# EAGLE design Power_5V&77V (EAGLE 7.1.0)
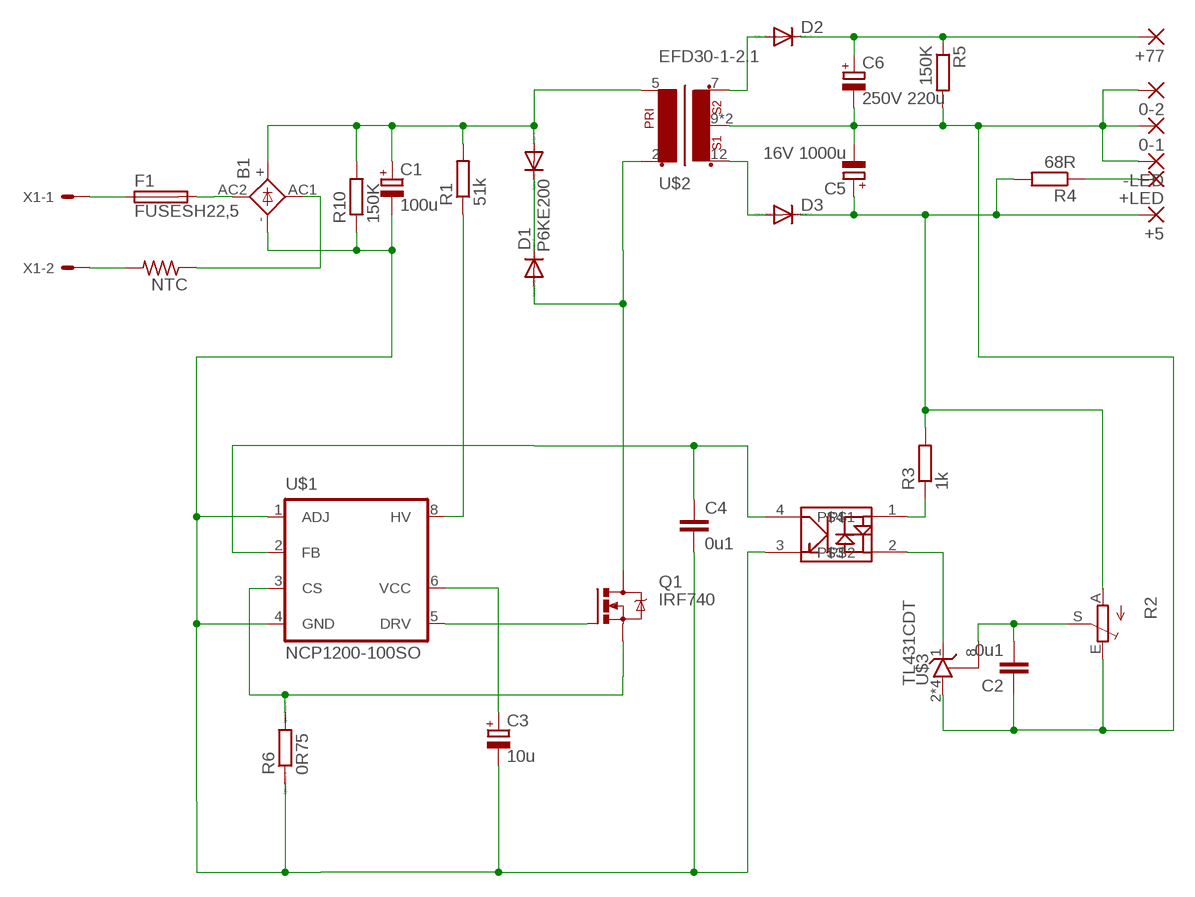
[diagram p0: schematic, sheet 1]

## Parts
0-1  2,54/0,8  [2,54/0,8]
0-2  3,17/1,1  [3,17/1,1]
+5  2,54/0,8  [2,54/0,8]
+77  3,17/1,1  [3,17/1,1]
+LED  2,54/0,8  [2,54/0,8]
-LED  2,54/0,8  [2,54/0,8]
B1  KBL  [KBL]
C1  100u  CPOL-EUE10-25  [EB25D]
C2  0u1  C-EUC1206  [C1206]
C3  10u  CPOL-EUE2.5-5  [E2,5-5]
C4  0u1  C-EUC1206  [C1206]
C5  16V 1000u  CPOL-EUE3.5-8  [E3,5-8]
C6  250V 220u  CPOL-EUE10-22.5  [EB22,5D]
D1  DIODE-DO-214AC  [DO-214AC]
D2  DIODE-TO220V  [TO220ACS]
D3  DIODE-SMB  [SMB]
F1  FUSESH22,5  SH22,5  [SH22,5]
NTC  R-US_0207/10  [0207/10]
P6KE200  DIODE-SMB  [SMB]
Q1  IRF740  [TO220BV]
R1  51k  R-EU_0922/22  [0922/22]
R2  TRIM_EU-S75H  [S75H]
R3  1k  R-EU_R1206  [R1206]
R4  68R  R-EU_R1206  [R1206]
R5  150K  R-EU_R1206  [R1206]
R6  0R75  R-EU_0411_15  [0411/15]
R10  150K  R-EU_0207/10  [0207/10]
U$1  NCP1200-100SO  [SOP8]
U$2  EFD30-1-2.1  [EFD30_1-2.1]
U$3  TL431CDT  [SO8]
U$5  EL3H4(TA)-VG  [SSOP4]
X1  KK-156-2  [KK-156-2]

## Nets
N$1: NTC.2 X1.2
N$2: F1.1 X1.1
N$3: B1.AC1(AC2) NTC.1
N$4: B1.AC2(AC1) F1.2
N$5: C4.1 U$1.2(FB) U$5.4
N$6: B1.+ C1.+ P6KE200.A R1.2 R10.2 U$2.5(P1-2)
N$7: D1.C P6KE200.C
N$8: D1.A Q1.D U$2.2(P1-1)
N$9: C2.2 R2.S U$3.8(R)
N$10: R1.1 U$1.8(HV)
N$11: Q1.G U$1.5(DRV)
N$12: Q1.S R6.2 U$1.3(CS)
N$13: R3.1 U$5.1
N$14: C3.+ U$1.6(VCC)
N$15: U$3.1(C) U$5.2
N$16: B1.- C1.- C3.- C4.2 R6.1 R10.1 U$1.1(ADJ) U$1.4(GND) U$5.3
N$17: D2.A U$2.7(S2)
N$18: 0-1.1(P) 0-2.1(P) -LED.1(P) C2.1 C5.- C6.- R2.E R5.2 U$2.9(S0) U$2.10(S0) U$3.2(A) U$3.3(A) U$3.6(A) U$3.7(A)
N$19: +5.1(P) C5.+ D3.C R2.A R3.2 R4.2
N$20: +77.1(P) C6.+ D2.C R5.1
N$21: D3.A U$2.12(S1)
N$23: +LED.1(P) R4.1

## Library data of the parts
0-1 +5 +LED -LED = wirepad:2,54/0,8: THROUGH-HOLE PAD
0-2 +77 = wirepad:3,17/1,1: THROUGH-HOLE PAD
B1 = rectifier:KBL: DIOTEC RECTIFIER
C1 C3 C5 C6 = rcl:CPOL-EU: POLARIZED CAPACITOR, European symbol
C2 C4 = rcl:C-EU: CAPACITOR, European symbol
D1-D3 P6KE200 = diode:DIODE-: DIODE
F1 = fuse:SH22,5: FUSE HOLDER grid 22,5 mm, OGN0031 8201, Schurter (Buerklin); MF: SCHURTER; MPN: 0031.8201; OC_FARNELL: 1162740; OC_NEWARK: 96F8317
NTC = rcl:R-US_: RESISTOR, American symbol
Q1 = transistor-power:IRF740: N-CHANNEL MOS FET
R1 R3-R5 R10 = rcl:R-EU_: RESISTOR, European symbol
R2 = pot:TRIM_EU-: POTENTIOMETER
R6 = resistor:R-EU_: RESISTOR, European symbol; SPICEPREFIX: R
U$1 = NCP1200:NCP1200-100
U$2 = EFD25:EFD30-1-2.1
U$3 = Namenlos:TL431
U$5 = Namenlos:EL3H4(TA)-VG
X1 = con-molex:KK-156-2: KK 156 HEADER Source: http://www.molex.com/pdm_docs/sd/026604100_sd.pdf; OC_FARNELL: unknown; OC_NEWARK: unknown

## Board
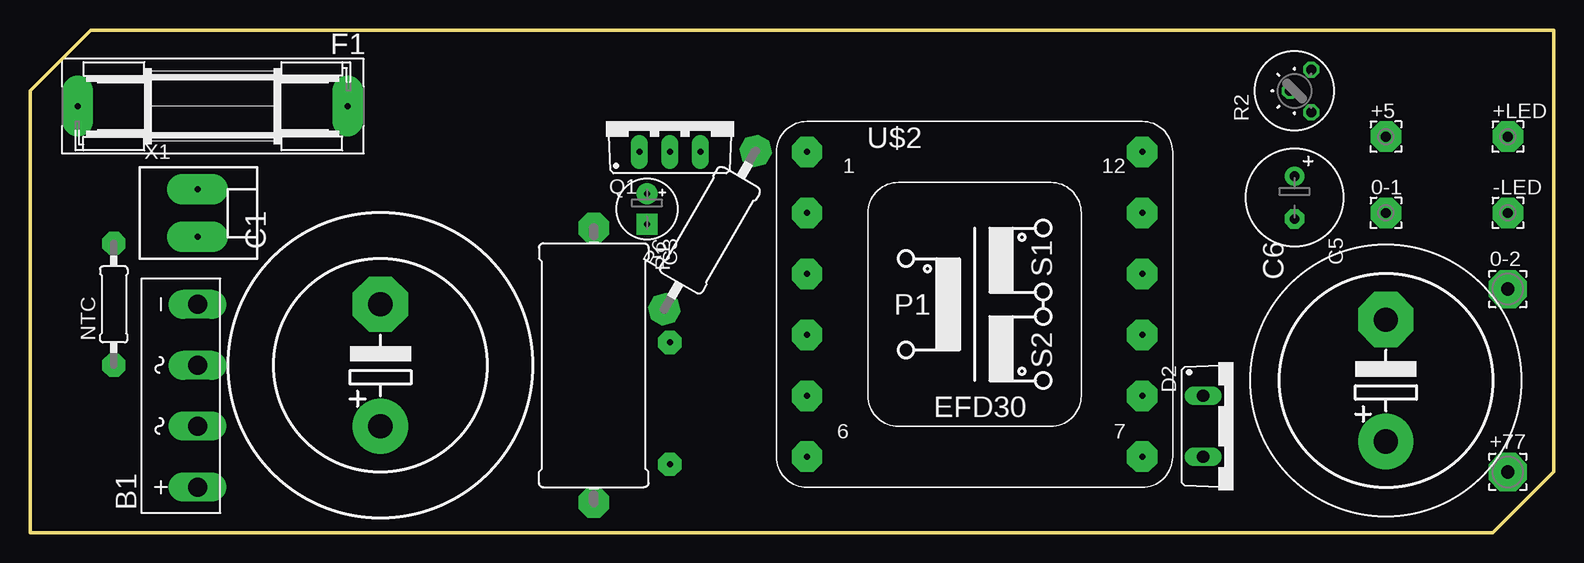
[diagram p1: board, top side]
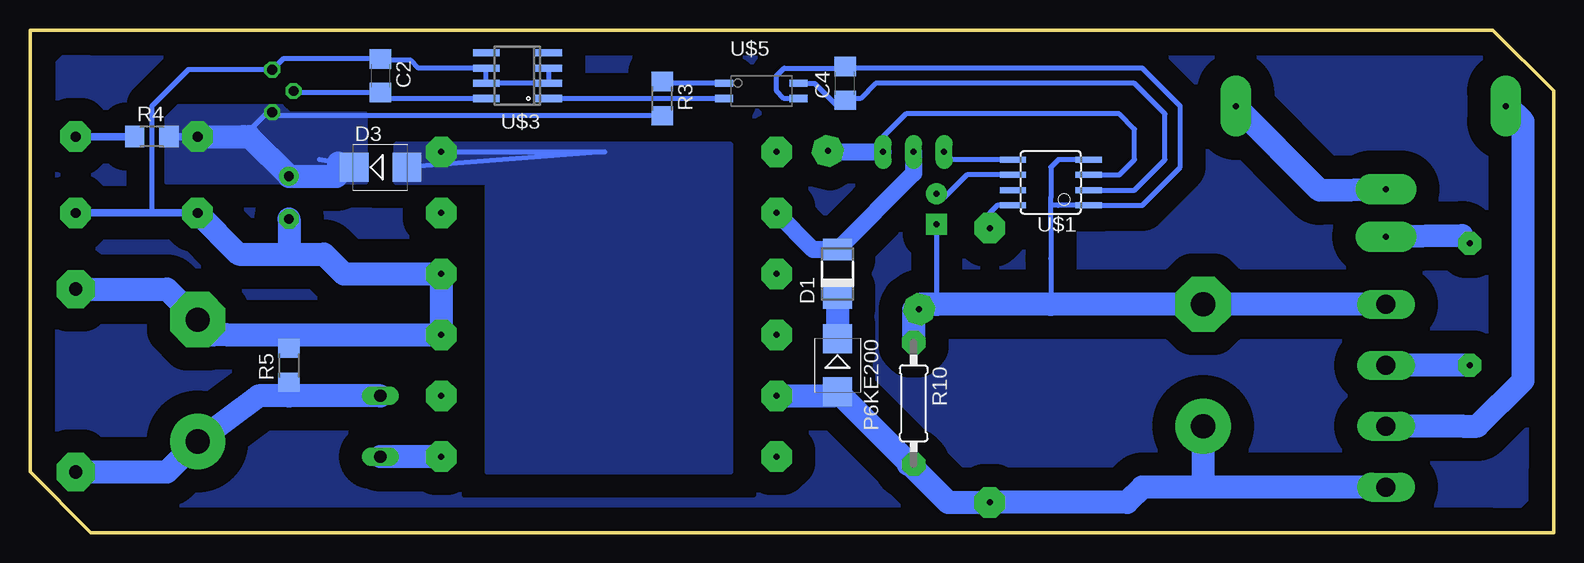
[diagram p2: board, bottom side, seen from below]

Size 127 x 41.91 mm. Coordinates in mm from the lower left corner, seen from the top.
Outline: 5.08,0 121.9,0 126.98,5.08 126.98,36.5
Outline: 5.08,0 0,0 0,5.08 0,36.83 5.08,41.91 121.92,41.91 127,41.91 127,36.83 127,35.56 127,5.08 121.92,0 5.08,0
Copper layers (1*16): Top 0.035mm / dielectric 1.5mm / Bottom 0.035mm
Design rules "default": minimum track width 10mil, minimum drill 24mil, track to track 8mil, track to pad 8mil, pad to pad 8mil, via to via 8mil, smd to smd 8mil, copper to edge 40mil, drill to drill 8mil, minimum pad ring 10mil, minimum via ring 8mil, stop-mask expansion 4mil, vias tented up to drill 0mil, thermal gap 10mil

### Footprints (pad centres in the part's own frame; a part is rotated, then mirrored left to right if it is on the bottom)
2,54/0,8 = drill 0.813 pad 2.54 octagon: 1 0,0
3,17/1,1 = drill 1.118 pad 3.175 octagon: 1 0,0
KBL = drill 1.6 long: + -7.62,-1.27; - 7.62,-1.27; AC1 2.54,-1.27; AC2 -2.54,-1.27
EB25D = drill 2.007 pad 4.597: + -5.08,0 | drill 2.007 pad 4.597 octagon: - 5.08,0
C1206 = smd 1.6 x 1.8: 1 -1.4,0; 2 1.4,0
E2,5-5 = drill 0.5 pad 1.778: + -1.27,0 | drill 0.5 pad 1.778 square: - 1.27,0
E3,5-8 = drill 0.813 pad 1.6: + -1.778,0 | drill 0.813 pad 1.6 octagon: - 1.778,0
EB22,5D = drill 2.007 pad 4.597: + -5.08,0 | drill 2.007 pad 4.597 octagon: - 5.08,0
DO-214AC = smd 1.8 x 2.4: A 2.025,0; C -2.025,0
TO220ACS = drill 1.016 long: A 2.54,-2.54; C -2.54,-2.54
SMB = smd 2.4 x 2.4: A 2.2,0; C -2.2,0
SH22,5 = drill 0.5 pad 2.54 long: 1 -11.252,0; 2 11.252,0
0207/10 = drill 0.5 pad 1.93 octagon: 1 -5.08,0; 2 5.08,0
TO220BV = drill 0.5 pad 1.422 long: D 0,-2.54; G -2.54,-2.54; S 2.54,-2.54
0922/22 = drill 0.5 pad 2.54 octagon: 1 -11.43,0; 2 11.43,0
S75H = drill 0.813 octagon: A -1.778,-1.397; E 1.778,-1.397; S 0,0.381
R1206 = smd 1.6 x 1.803: 1 -1.422,0; 2 1.422,0
0411/15 = drill 0.5 pad 2.54 octagon: 1 -7.62,0; 2 7.62,0
SOP8 = smd 0.5 x 2.2: 1 -1.905,-3.154; 2 -0.645,-3.154; 3 0.625,-3.154; 4 1.895,-3.154; 5 1.905,3.154; 6 0.635,3.154; 7 -0.635,3.154; 8 -1.905,3.154
EFD30_1-2.1 = drill 0.5 pad 2.54 octagon: 1 -13.97,12.7; 2 -13.97,7.62; 3 -13.97,2.54; 4 -13.97,-2.54; 5 -13.97,-7.62; 6 -13.97,-12.7; 7 13.97,-12.7; 8 13.97,-7.62; 9 13.97,-2.54; 10 13.97,2.54; 11 13.97,7.62; 12 13.97,12.7
SO8 = smd 0.6 x 2.2: 1 -1.905,-2.6; 2 -0.635,-2.6; 3 0.635,-2.6; 4 1.905,-2.6; 5 1.905,2.6; 6 0.635,2.6; 7 -0.635,2.6; 8 -1.905,2.6
SSOP4 = smd 0.6 x 1.5: 1 -0.635,-3.115; 2 0.635,-3.115; 3 0.635,3.115; 4 -0.635,3.115
KK-156-2 = drill 0.5 pad 2.54 long: 1 -1.98,0; 2 1.98,0

### Placement (x,y rotation side)
0-1  113.03,26.67 0 top
0-2  123.19,20.32 0 top
+5  113.03,33.02 0 top
+77  123.19,5.08 0 top
+LED  123.19,33.02 0 top
-LED  123.19,26.67 0 top
B1  12.7,11.43 90 top
C1  29.21,13.97 90 top
C2  97.79,38.1 270 bottom
C3  51.44,26.99 270 top
C4  59.06,37.46 90 bottom
C5  105.41,27.94 270 top
C6  113.03,12.7 90 top
D1  59.69,21.59 90 bottom
D2  100.33,8.89 270 top
D3  97.79,30.48 0 bottom
F1  15.24,35.56 180 top
NTC  6.98,19.05 90 top
P6KE200  59.69,13.97 270 bottom
Q1  53.34,34.29 0 top
R1  46.99,13.97 270 top
R2  105.41,36.83 90 top
R3  74.3,36.2 270 bottom
R4  116.84,33.02 0 bottom
R5  105.41,13.97 90 bottom
R6  56.69,25.23 60 top
R10  53.34,10.79 270 bottom
U$1  41.91,29.21 90 bottom
U$2  78.74,19.05 0 top
U$3  86.36,38.1 90 bottom
U$5  66.04,36.83 270 bottom
X1  13.97,26.67 270 top

### Tracks (layer width: path | path; a pad name or v marks a point on that pad's centre or on a via)
N$1
  Bottom 0.406: NTC.2 7.62,24.76
  Bottom 1.93: 7.62,24.76 X1.2
N$2
  Bottom 1.93: F1.1 19.51,28.57 X1.1
N$3
  Bottom 1.93: NTC.1 B1.AC1
N$4
  Bottom 1.93: B1.AC2 7.62,8.89 6.35,8.89 2.54,12.7 2.54,34.29 3.81,35.56 F1.2
N$5
  Bottom 0.406: U$1.2 34.94,28.56 32.39,31.12 32.39,34.93 34.92,37.46 56.52,37.46 57.78,36.2 58.92,36.2 C4.1 59.56,35.56 59.69,35.56 61.59,37.46 U$5.4
N$6
  Bottom 0.406: 60.03,11.43 P6KE200.A
  Bottom 1.93: P6KE200.A 53.81,5.88 | 53.81,5.88 53.17,5.25 50.46,2.54 R1.2 35.56,2.54 34.29,3.81 33.02,3.81 29.21,3.81 | U$2.5 60.03,11.43 | B1.+ 29.21,3.81 | C1.+ 29.21,3.81 | R10.2 53.81,5.71 53.81,5.88
N$7
  Bottom 1.93: D1.C P6KE200.C
N$8
  Bottom 1.422: Q1.D 53.34,29.96 D1.A 61.72,23.62 U$2.2
N$9
  Bottom 0.406: 105.16,36.7 R2.S 104.9,36.7 C2.2 97.28,36.2 U$3.8
N$10
  Bottom 0.406: U$1.8 45.09,27.3 46.36,27.3 46.99,26.67 R1.1
N$11
  Bottom 0.406: U$1.5 50.17,31.12 Q1.G
N$12
  Bottom 0.406: U$1.3 36.2,29.84 34.92,31.12 34.92,33.65 36.19,34.93 53.98,34.93 55.88,33.02 Q1.S | R6.2 60.42,31.75
  Bottom 1.422: 60.42,31.75 Q1.S
N$13
  Bottom 0.406: U$5.1 74.14,37.46 R3.1
N$14
  Bottom 0.406: U$1.6 48.89,29.84 50.8,27.94 C3.+
N$15
  Bottom 0.406: U$5.2 U$3.1
N$16
  Bottom 0.406: U$1.4 41.28,31.1 41.91,30.48 41.91,27.94 41.91,27.3 | 41.91,27.3 41.91,25.4 41.91,22.86 41.91,19.05 | U$5.3 64.14,36.2 64.77,36.83 64.77,38.1 64.14,38.73 59.19,38.73 C4.2 58.92,38.73 34.29,38.73 31.11,35.56 31.11,30.48 34.29,27.3 U$1.1 41.28,27.3 41.91,27.3 | R6.1 52.46,19.05 | C3.- 51.44,19.05
  Bottom 1.93: B1.- C1.- 41.91,19.05 51.44,19.05 52.88,19.05 R6.1 53.34,18.63 R10.1
N$17
  Bottom 1.93: U$2.7 D2.A
N$18
  Bottom 0.406: U$3.3 U$3.2 U$3.7 U$3.6 94.62,38.73 95.25,39.37 97.66,39.37 C2.1 105.92,39.5 R2.E 113.79,38.61 116.84,35.56 116.84,31.12 116.84,26.67 | R5.2 105.41,16.51
  Bottom 0.61: -LED.1 116.84,26.67 0-1.1
  Bottom 1.93: 0-1.1 109.6,23.24 105.41,23.24 | 105.41,23.24 102.49,23.24 100.84,21.59 U$2.10 U$2.9 105.41,16.51 110.49,16.51 111.76,16.51 C6.- 115.57,20.32 0-2.1 | C5.- 105.41,23.24
N$19
  Bottom 0.406: R3.2 98.58,34.77 106.53,34.77 R2.A 107.19,35.05 109.22,33.02 | 101.31,30.82 101.28,30.8 101.31,30.82 | 101.31,30.82 102.87,31.12 | 101.47,29.72 101.31,30.82
  Bottom 0.61: +5.1 R4.2
  Bottom 1.93: D3.C 101.31,30.82 101.28,30.8 | 101.47,29.72 C5.+ 108.71,33.02 109.22,33.02 +5.1
  pour Bottom (no thermals): 99.06,29.21 115.57,29.21 115.57,34.56 114.57,35.56 106.05,35.56 105.41,34.93 99.06,34.93
N$20
  Bottom 0.406: R5.1 105.41,11.43
  Bottom 1.93: D2.C 105.41,11.43 107.95,11.43 C6.+ 115.57,5.08 +77.1
N$21
  Bottom 0.406: 93.05,31.41 U$2.12 79.08,31.75 D3.A
  pour Bottom (no thermals): 96.52,29.21 88.9,29.21 88.9,5.08 68.58,5.08 68.58,32.38 96.52,32.38
N$22
  pour Bottom (isolate 1.93, rank 2, no thermals): 5.08,0 121.92,0 127,5.08 127,36.83 121.92,41.91 5.08,41.91 0,36.83 0,5.08
N$23
  Bottom 0.61: R4.1 +LED.1